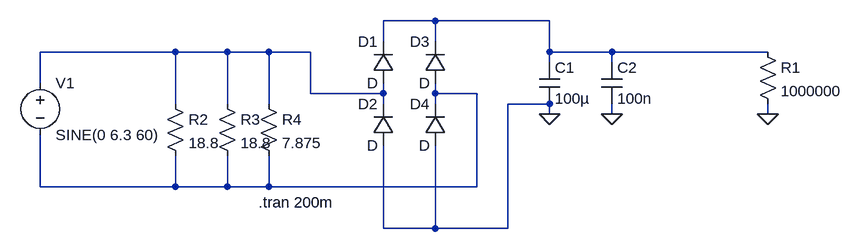
[diagram p0: schematic 6.3V-rectifier.asc]
6.3V-rectifier.asc, the LTspice schematic file:
Version 4.1
SHEET 1 880 680
WIRE 144 32 64 32
WIRE 320 32 144 32
WIRE 64 64 64 32
WIRE 144 64 144 32
WIRE -256 80 -464 80
WIRE -176 80 -256 80
WIRE -112 80 -176 80
WIRE -48 80 -112 80
WIRE 320 80 320 32
WIRE 416 80 320 80
WIRE 656 80 416 80
WIRE 320 96 320 80
WIRE 416 96 416 80
WIRE -464 128 -464 80
WIRE -48 144 -48 80
WIRE 64 144 64 128
WIRE 64 144 -48 144
WIRE 144 144 144 128
WIRE 208 144 144 144
WIRE -256 160 -256 80
WIRE -176 160 -176 80
WIRE -112 160 -112 80
WIRE 64 160 64 144
WIRE 144 160 144 144
WIRE 320 160 256 160
WIRE 320 176 320 160
WIRE 416 176 416 160
WIRE 656 176 656 160
WIRE -464 288 -464 208
WIRE -256 288 -256 240
WIRE -256 288 -464 288
WIRE -176 288 -176 240
WIRE -176 288 -256 288
WIRE -112 288 -112 240
WIRE -112 288 -176 288
WIRE 208 288 208 144
WIRE 208 288 -112 288
WIRE 64 352 64 224
WIRE 144 352 144 224
WIRE 144 352 64 352
WIRE 256 352 256 160
WIRE 256 352 144 352
FLAG 320 176 0
FLAG 416 176 0
FLAG 656 176 0
SYMBOL voltage -464 112 R0
WINDOW 123 0 0 Left 0
WINDOW 39 0 0 Left 0
SYMATTR InstName V1
SYMATTR Value SINE(0 6.3 60)
SYMBOL cap 304 96 R0
SYMATTR InstName C1
SYMATTR Value 100µ
SYMBOL cap 400 96 R0
SYMATTR InstName C2
SYMATTR Value 100n
SYMBOL res 640 64 R0
SYMATTR InstName R1
SYMATTR Value 1000000
SYMBOL res -272 144 R0
SYMATTR InstName R2
SYMATTR Value 18.8
SYMBOL res -192 144 R0
SYMATTR InstName R3
SYMATTR Value 18.8
SYMBOL res -128 144 R0
SYMATTR InstName R4
SYMATTR Value 7.875
SYMBOL diode 80 128 R180
WINDOW 0 24 64 Left 2
WINDOW 3 24 0 Left 2
SYMATTR InstName D1
SYMBOL diode 80 224 R180
WINDOW 0 24 64 Left 2
WINDOW 3 24 0 Left 2
SYMATTR InstName D2
SYMBOL diode 160 128 R180
WINDOW 0 24 64 Left 2
WINDOW 3 24 0 Left 2
SYMATTR InstName D3
SYMBOL diode 160 224 R180
WINDOW 0 24 64 Left 2
WINDOW 3 24 0 Left 2
SYMATTR InstName D4
TEXT -128 312 Left 2 !.tran 200m

The netlist it stands for:
* 6.3V-rectifier.asc
V1 N002 N003 SINE(0 6.3 60)
C1 N001 0 100µ
C2 N001 0 100n
R1 N001 0 1000000
R2 N002 N003 18.8
R3 N002 N003 18.8
R4 N002 N003 7.875
D1 N002 N001 D
D2 0 N002 D
D3 N003 N001 D
D4 0 N003 D
.model D D
.lib standard.dio
.tran 200m
.backanno
.end